# Altium schematic sheet Gate Drives.SchDoc
size D
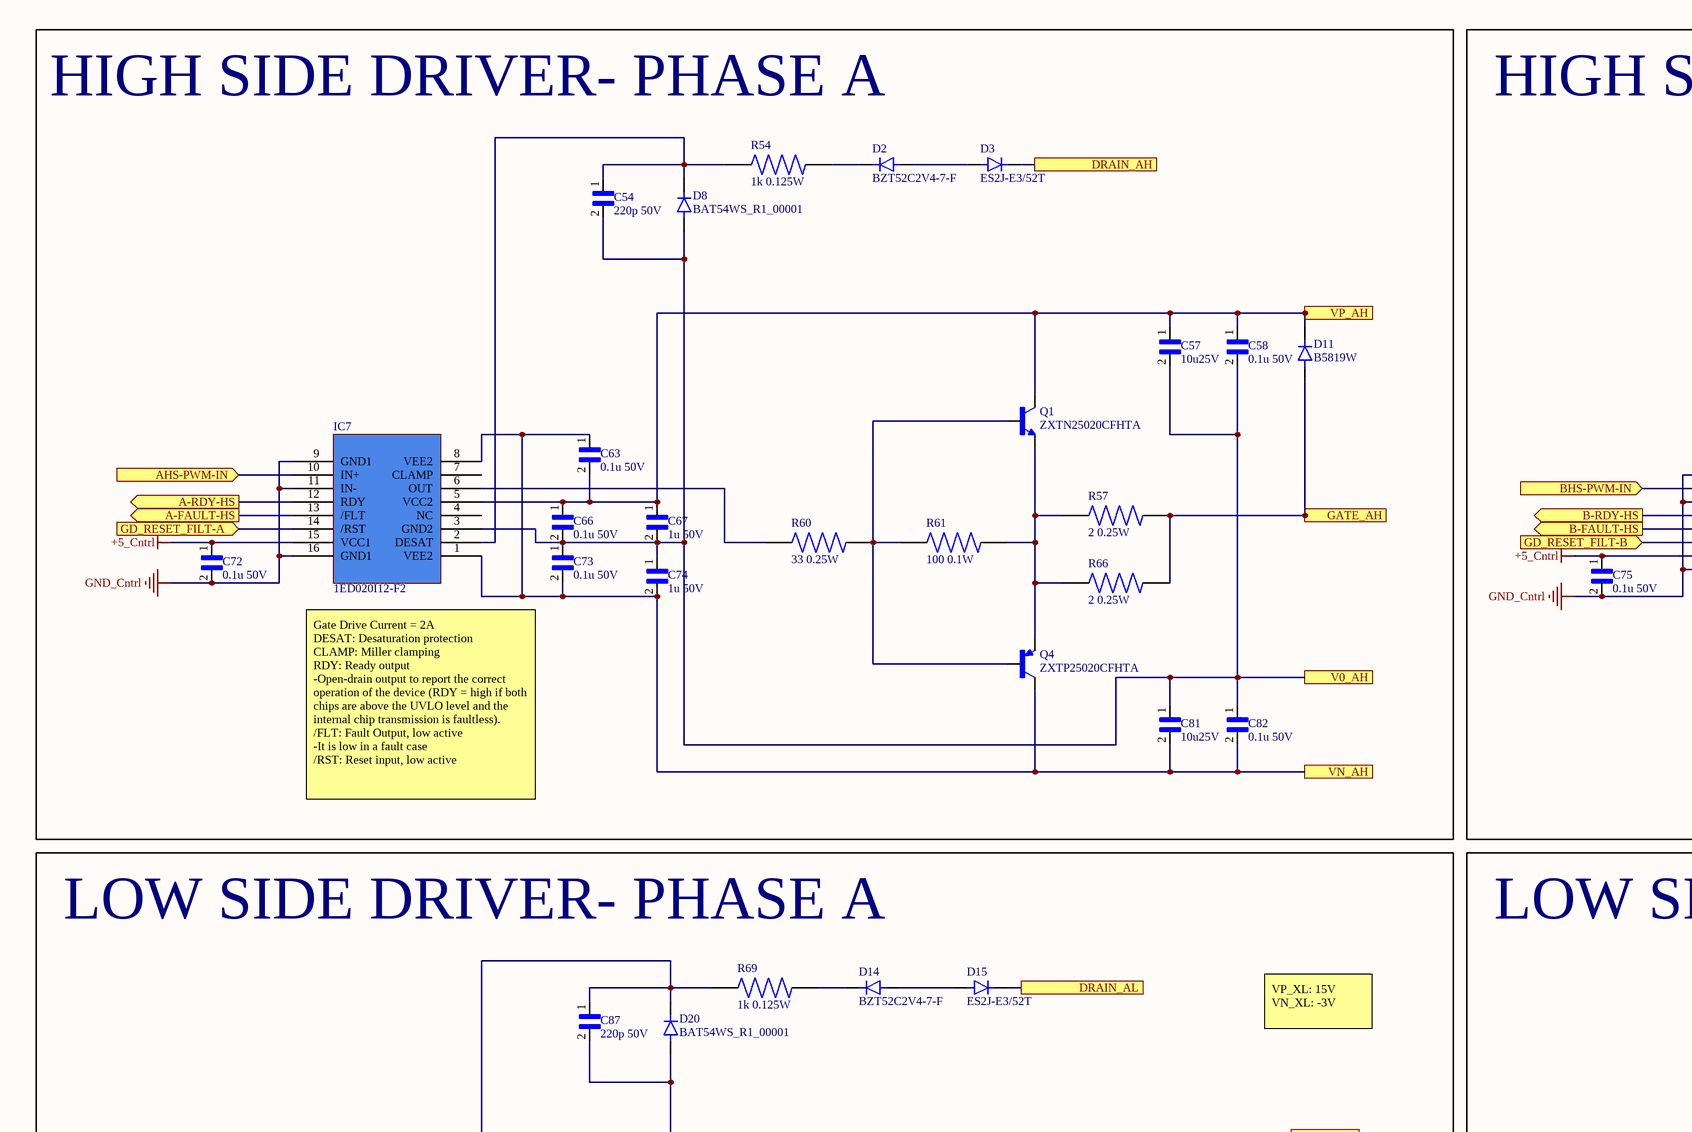
[diagram p0: Gate Drives.SchDoc, top left]
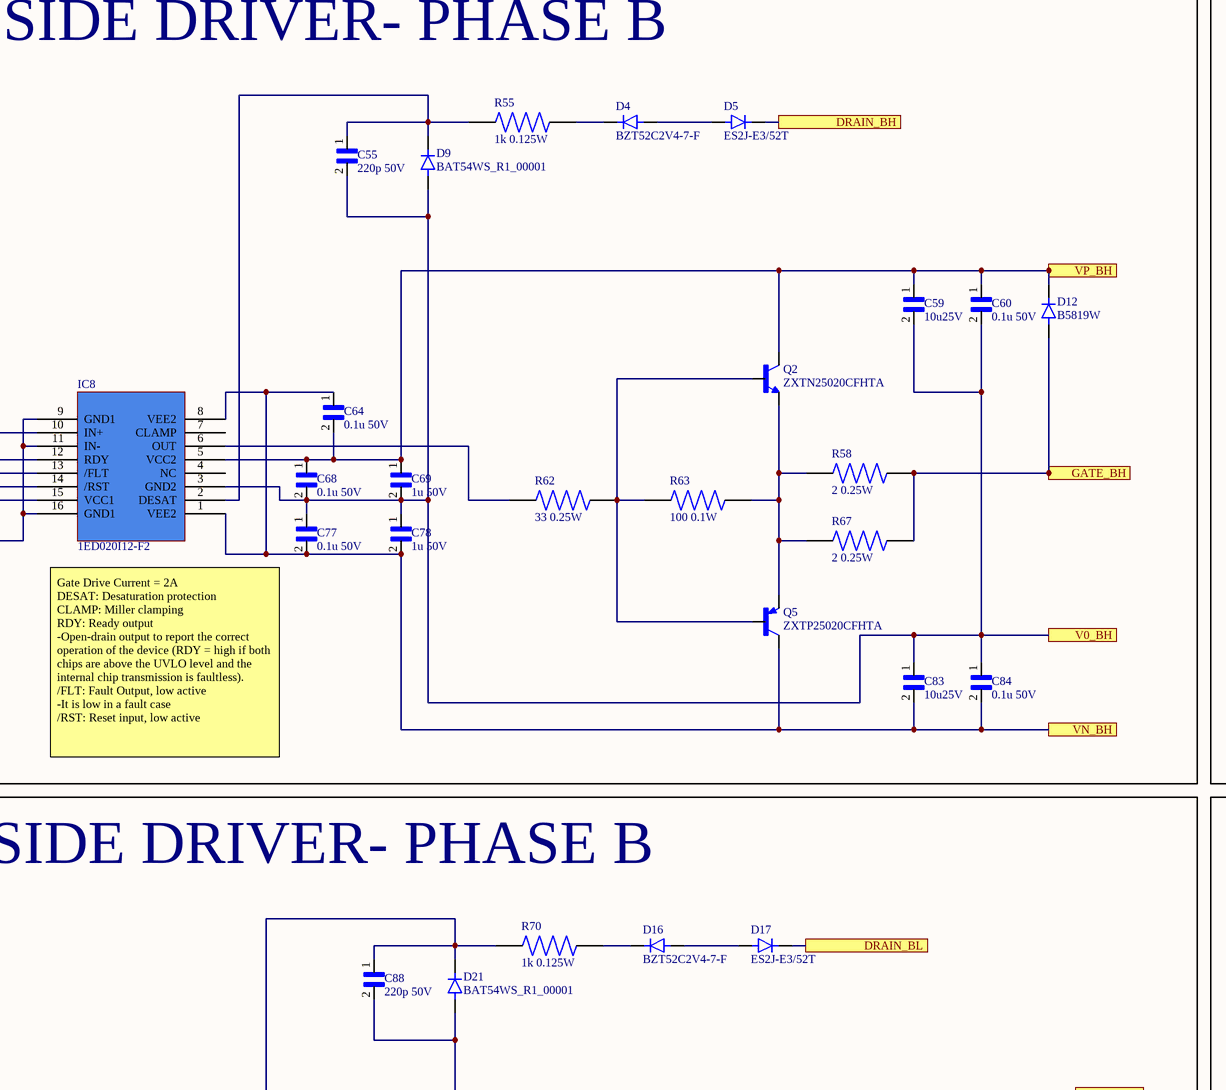
[diagram p1: Gate Drives.SchDoc, top middle]
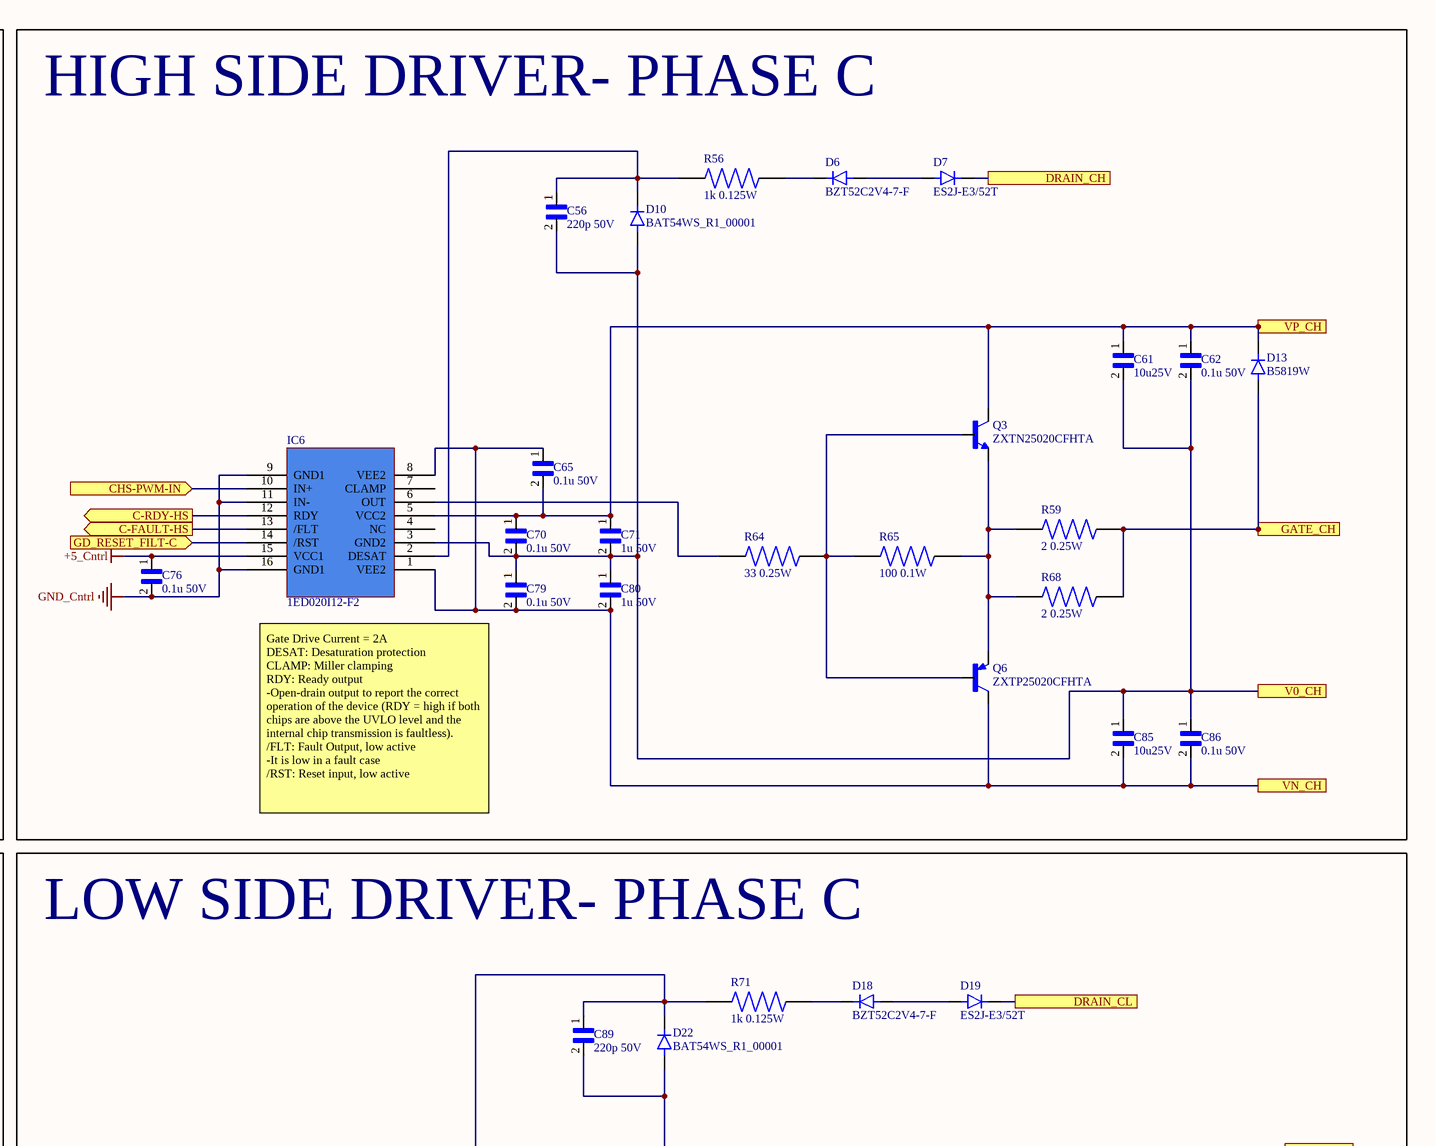
[diagram p2: Gate Drives.SchDoc, top right]
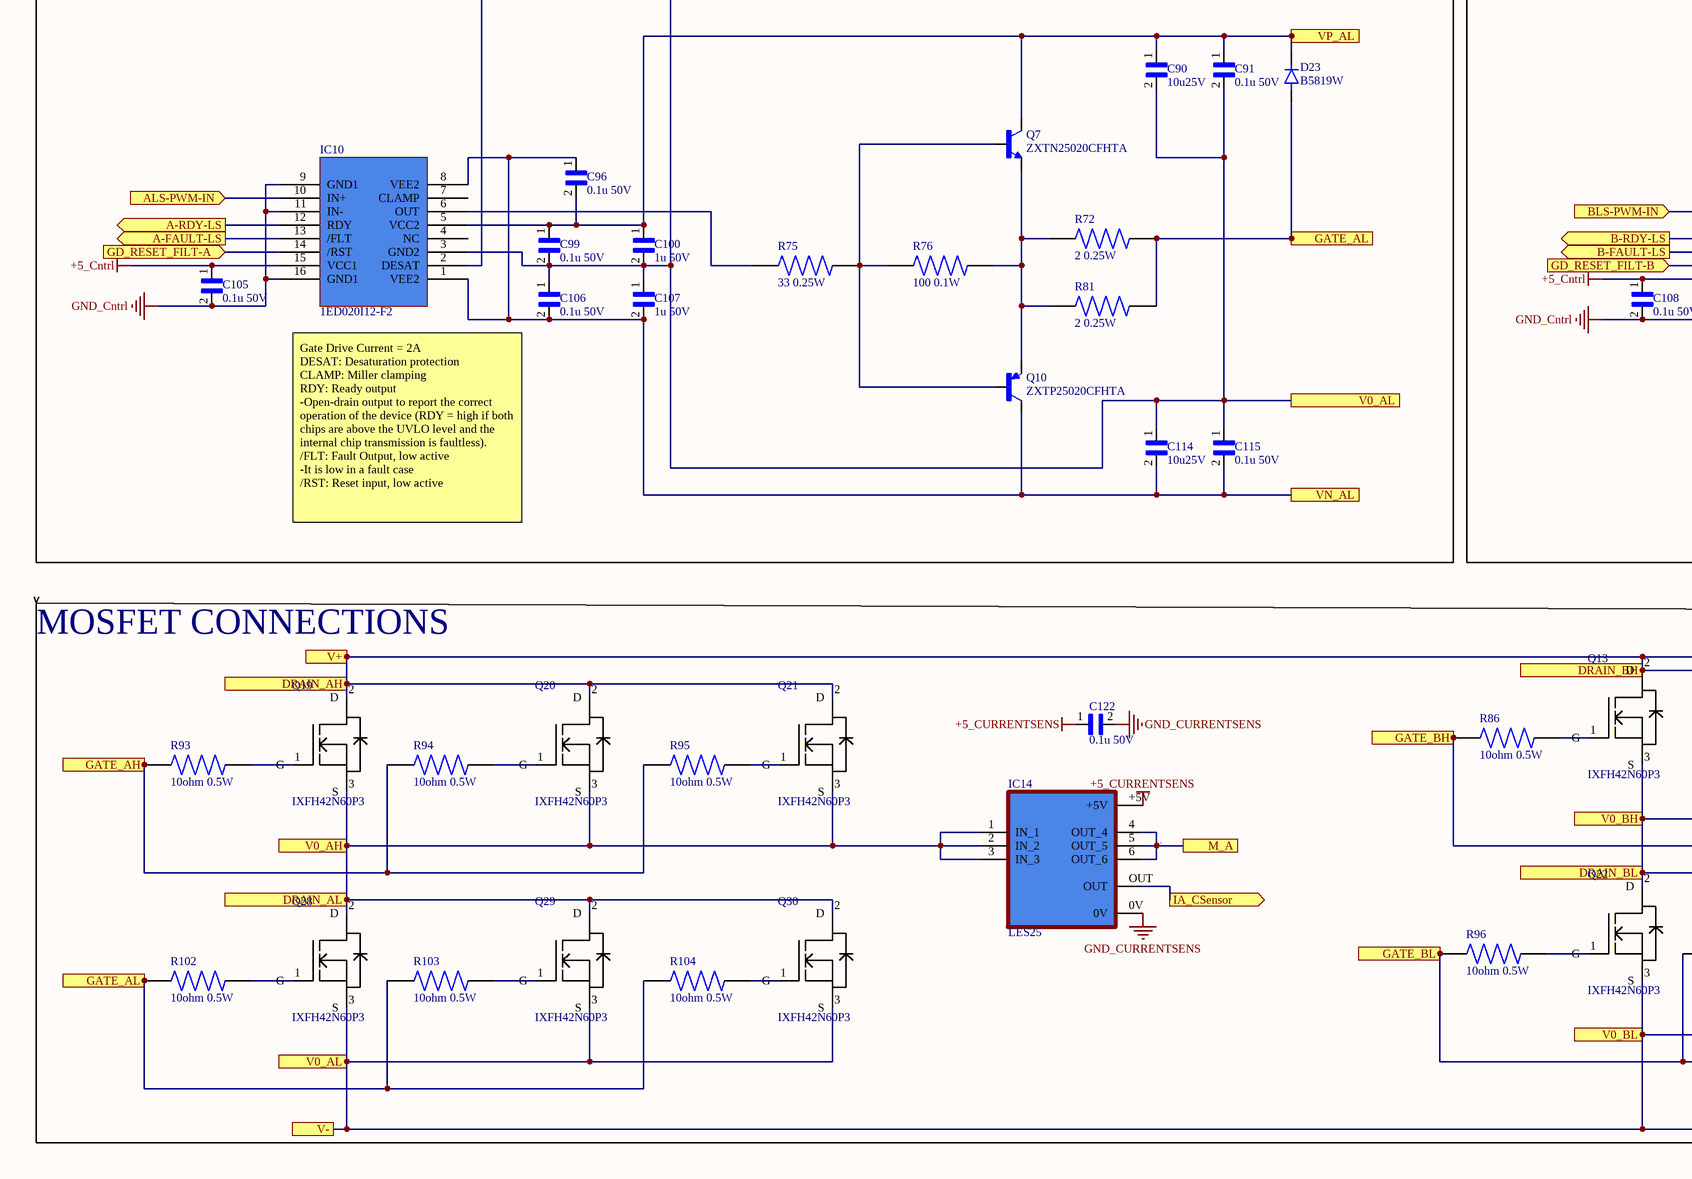
[diagram p3: Gate Drives.SchDoc, bottom left]
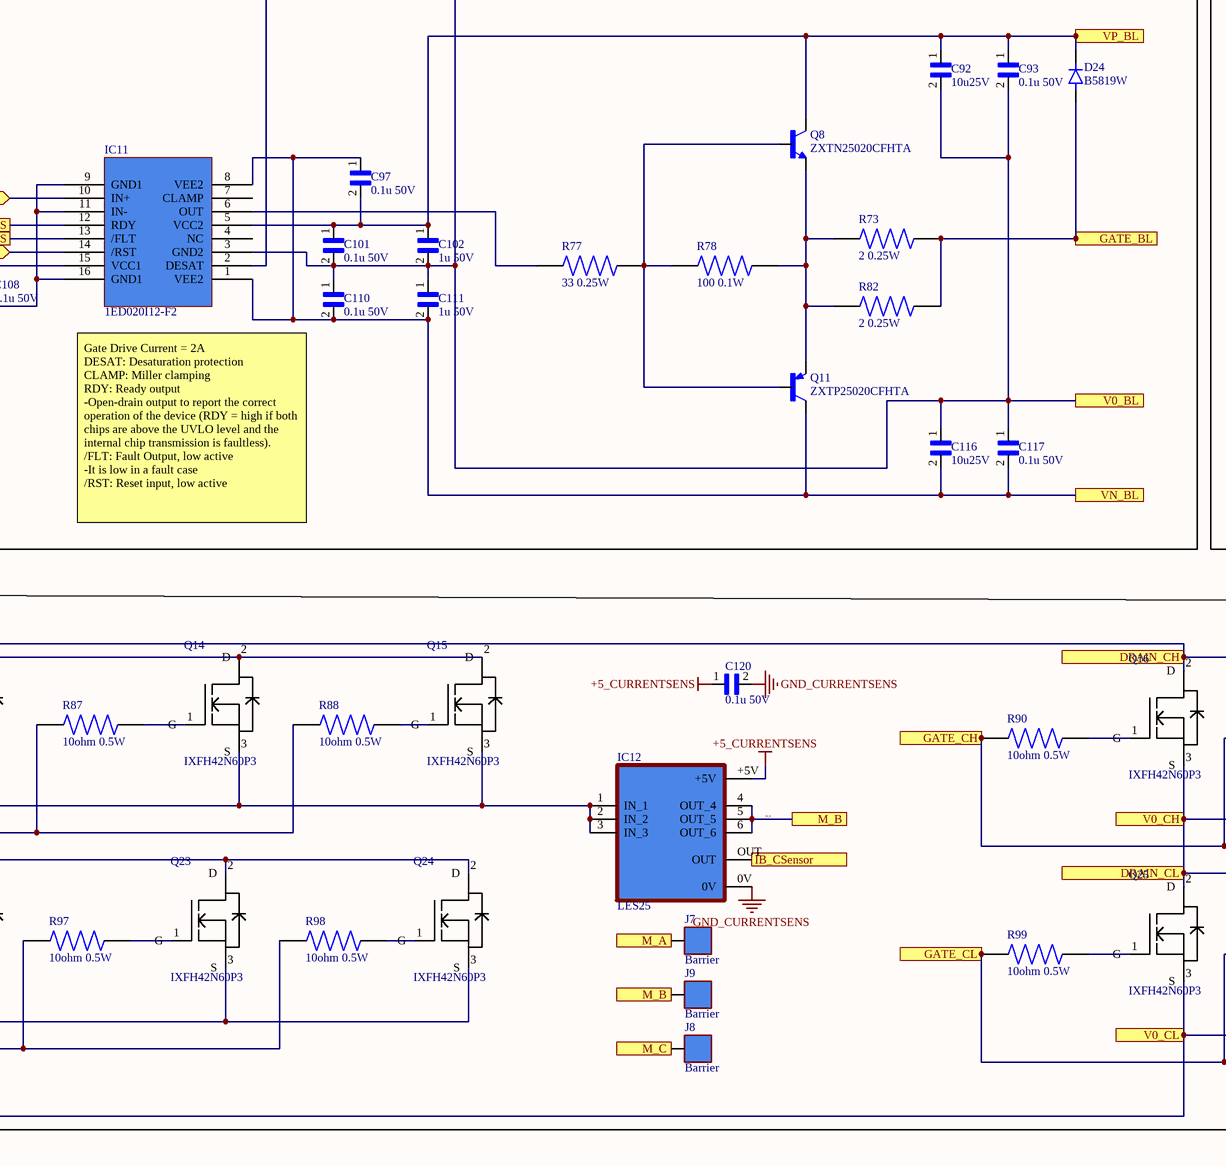
[diagram p4: Gate Drives.SchDoc, bottom middle]
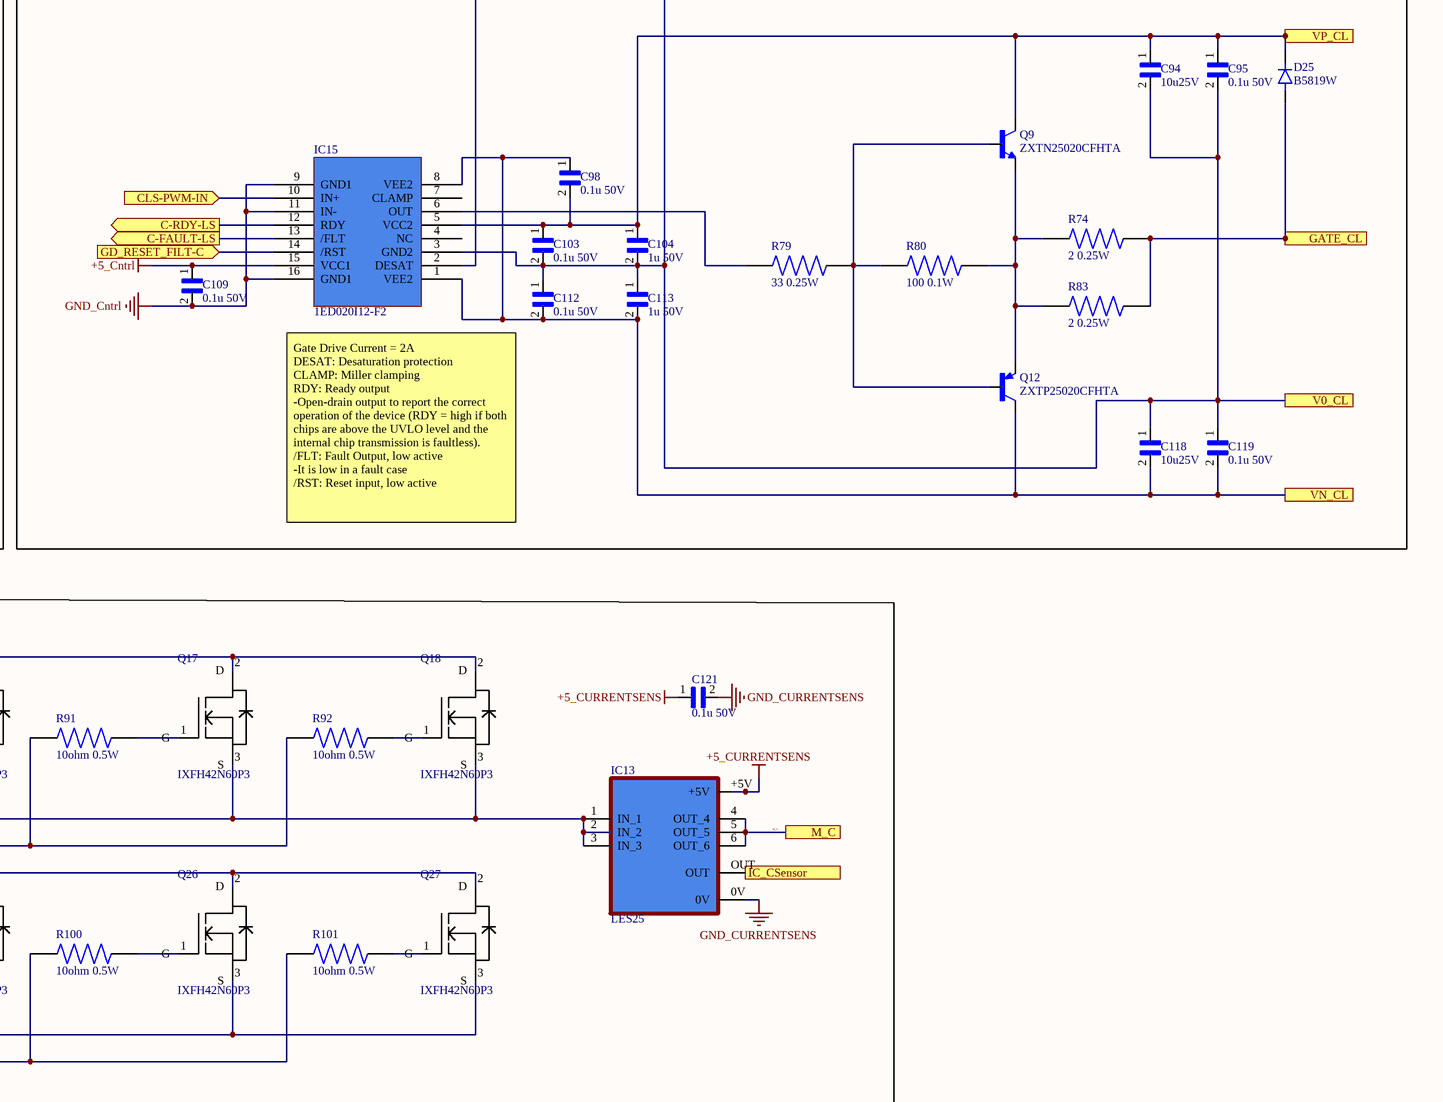
[diagram p5: Gate Drives.SchDoc, bottom right]

## Parts
C54  220p 50V  [CAP0805]
C55  220p 50V  [CAP0805]
C56  220p 50V  [CAP0805]
C57  10u25V  [CAP0805]
C58  0.1u 50V  [CAP0805]
C59  10u25V  [CAP0805]
C60  0.1u 50V  [CAP0805]
C61  10u25V  [CAP0805]
C62  0.1u 50V  [CAP0805]
C63  0.1u 50V  [CAP0805]
C64  0.1u 50V  [CAP0805]
C65  0.1u 50V  [CAP0805]
C66  0.1u 50V  [CAP0805]
C67  1u 50V  [CAP0805]
C68  0.1u 50V  [CAP0805]
C69  1u 50V  [CAP0805]
C70  0.1u 50V  [CAP0805]
C71  1u 50V  [CAP0805]
C72  0.1u 50V  [CAP0805]
C73  0.1u 50V  [CAP0805]
C74  1u 50V  [CAP0805]
C75  0.1u 50V  [CAP0805]
C76  0.1u 50V  [CAP0805]
C77  0.1u 50V  [CAP0805]
C78  1u 50V  [CAP0805]
C79  0.1u 50V  [CAP0805]
C80  1u 50V  [CAP0805]
C81  10u25V  [CAP0805]
C82  0.1u 50V  [CAP0805]
C83  10u25V  [CAP0805]
C84  0.1u 50V  [CAP0805]
C85  10u25V  [CAP0805]
C86  0.1u 50V  [CAP0805]
C87  220p 50V  [CAP0805]
C88  220p 50V  [CAP0805]
C89  220p 50V  [CAP0805]
C90  10u25V  [CAP0805]
C91  0.1u 50V  [CAP0805]
C92  10u25V  [CAP0805]
C93  0.1u 50V  [CAP0805]
C94  10u25V  [CAP0805]
C95  0.1u 50V  [CAP0805]
C96  0.1u 50V  [CAP0805]
C97  0.1u 50V  [CAP0805]
C98  0.1u 50V  [CAP0805]
C99  0.1u 50V  [CAP0805]
C100  1u 50V  [CAP0805]
C101  0.1u 50V  [CAP0805]
C102  1u 50V  [CAP0805]
C103  0.1u 50V  [CAP0805]
C104  1u 50V  [CAP0805]
C105  0.1u 50V  [CAP0805]
C106  0.1u 50V  [CAP0805]
C107  1u 50V  [CAP0805]
C108  0.1u 50V  [CAP0805]
C109  0.1u 50V  [CAP0805]
C110  0.1u 50V  [CAP0805]
C111  1u 50V  [CAP0805]
C112  0.1u 50V  [CAP0805]
C113  1u 50V  [CAP0805]
C114  10u25V  [CAP0805]
C115  0.1u 50V  [CAP0805]
C116  10u25V  [CAP0805]
C117  0.1u 50V  [CAP0805]
C118  10u25V  [CAP0805]
C119  0.1u 50V  [CAP0805]
C120  0.1u 50V  [CAP0805]
C121  0.1u 50V  [CAP0805]
C122  0.1u 50V  [CAP0805]
D2  BZT52C2V4-7-F  [BZT52C2V4-7-F]
D3  ES2J-E3/52T  [ES2J-E3/52T]
D4  BZT52C2V4-7-F  [BZT52C2V4-7-F]
D5  ES2J-E3/52T  [ES2J-E3/52T]
D6  BZT52C2V4-7-F  [BZT52C2V4-7-F]
D7  ES2J-E3/52T  [ES2J-E3/52T]
D8  BAT54WS_R1_00001  [BAT54WS_R1_00001]
D9  BAT54WS_R1_00001  [BAT54WS_R1_00001]
D10  BAT54WS_R1_00001  [BAT54WS_R1_00001]
D11  B5819W  [BZT52C2V4-7-F]
D12  B5819W  [BZT52C2V4-7-F]
D13  B5819W  [BZT52C2V4-7-F]
D14  BZT52C2V4-7-F  [BZT52C2V4-7-F]
D15  ES2J-E3/52T  [ES2J-E3/52T]
D16  BZT52C2V4-7-F  [BZT52C2V4-7-F]
D17  ES2J-E3/52T  [ES2J-E3/52T]
D18  BZT52C2V4-7-F  [BZT52C2V4-7-F]
D19  ES2J-E3/52T  [ES2J-E3/52T]
D20  BAT54WS_R1_00001  [BAT54WS_R1_00001]
D21  BAT54WS_R1_00001  [BAT54WS_R1_00001]
D22  BAT54WS_R1_00001  [BAT54WS_R1_00001]
D23  B5819W  [BZT52C2V4-7-F]
D24  B5819W  [BZT52C2V4-7-F]
D25  B5819W  [BZT52C2V4-7-F]
IC6  1ED020I12-F2  [SOIC127P1028X264-16N]
IC7  1ED020I12-F2  [SOIC127P1028X264-16N]
IC8  1ED020I12-F2  [SOIC127P1028X264-16N]
IC10  1ED020I12-F2  [SOIC127P1028X264-16N]
IC11  1ED020I12-F2  [SOIC127P1028X264-16N]
IC12  LES25  [LTS25]
IC13  LES25  [LTS25]
IC14  LES25  [LTS25]
IC15  1ED020I12-F2  [SOIC127P1028X264-16N]
J7  Barrier  [Barrier]
J8  Barrier  [Barrier]
J9  Barrier  [Barrier]
Q1  ZXTN25020CFHTA  [SOT23]
Q2  ZXTN25020CFHTA  [SOT23]
Q3  ZXTN25020CFHTA  [SOT23]
Q4  ZXTP25020CFHTA  [SOT23]
Q5  ZXTP25020CFHTA  [SOT23]
Q6  ZXTP25020CFHTA  [SOT23]
Q7  ZXTN25020CFHTA  [SOT23]
Q8  ZXTN25020CFHTA  [SOT23]
Q9  ZXTN25020CFHTA  [SOT23]
Q10  ZXTP25020CFHTA  [SOT23]
Q11  ZXTP25020CFHTA  [SOT23]
Q12  ZXTP25020CFHTA  [SOT23]
Q13  IXFH42N60P3  [IXFH42N60P3_v4]
Q14  IXFH42N60P3  [IXFH42N60P3_v4]
Q15  IXFH42N60P3  [IXFH42N60P3_v4]
Q16  IXFH42N60P3  [IXFH42N60P3_v4]
Q17  IXFH42N60P3  [IXFH42N60P3_v4]
Q18  IXFH42N60P3  [IXFH42N60P3_v4]
Q19  IXFH42N60P3  [IXFH42N60P3_v4]
Q20  IXFH42N60P3  [IXFH42N60P3_v4]
Q21  IXFH42N60P3  [IXFH42N60P3_v4]
Q22  IXFH42N60P3  [IXFH42N60P3_v4]
Q23  IXFH42N60P3  [IXFH42N60P3_v4]
Q24  IXFH42N60P3  [IXFH42N60P3_v4]
Q25  IXFH42N60P3  [IXFH42N60P3_v4]
Q26  IXFH42N60P3  [IXFH42N60P3_v4]
Q27  IXFH42N60P3  [IXFH42N60P3_v4]
Q28  IXFH42N60P3  [IXFH42N60P3_v4]
Q29  IXFH42N60P3  [IXFH42N60P3_v4]
Q30  IXFH42N60P3  [IXFH42N60P3_v4]
R54  1k 0.125W  [RES0805]
R55  1k 0.125W  [RES0805]
R56  1k 0.125W  [RES0805]
R57  2 0.25W  [RES0805]
R58  2 0.25W  [RES0805]
R59  2 0.25W  [RES0805]
R60  33 0.25W  [RES0805]
R61  100 0.1W  [RES0805]
R62  33 0.25W  [RES0805]
R63  100 0.1W  [RES0805]
R64  33 0.25W  [RES0805]
R65  100 0.1W  [RES0805]
R66  2 0.25W  [RES0805]
R67  2 0.25W  [RES0805]
R68  2 0.25W  [RES0805]
R69  1k 0.125W  [RES0805]
R70  1k 0.125W  [RES0805]
R71  1k 0.125W  [RES0805]
R72  2 0.25W  [RES0805]
R73  2 0.25W  [RES0805]
R74  2 0.25W  [RES0805]
R75  33 0.25W  [RES0805]
R76  100 0.1W  [RES0805]
R77  33 0.25W  [RES0805]
R78  100 0.1W  [RES0805]
R79  33 0.25W  [RES0805]
R80  100 0.1W  [RES0805]
R81  2 0.25W  [RES0805]
R82  2 0.25W  [RES0805]
R83  2 0.25W  [RES0805]
R86  10ohm 0.5W  [1206RES]
R87  10ohm 0.5W  [1206RES]
R88  10ohm 0.5W  [1206RES]
R90  10ohm 0.5W  [1206RES]
R91  10ohm 0.5W  [1206RES]
R92  10ohm 0.5W  [1206RES]
R93  10ohm 0.5W  [1206RES]
R94  10ohm 0.5W  [1206RES]
R95  10ohm 0.5W  [1206RES]
R96  10ohm 0.5W  [1206RES]
R97  10ohm 0.5W  [1206RES]
R98  10ohm 0.5W  [1206RES]
R99  10ohm 0.5W  [1206RES]
R100  10ohm 0.5W  [1206RES]
R101  10ohm 0.5W  [1206RES]
R102  10ohm 0.5W  [1206RES]
R103  10ohm 0.5W  [1206RES]
R104  10ohm 0.5W  [1206RES]

## Blocks framed on the sheet
HIGH SIDE DRIVER- PHASE A: C54 C57 C58 C63 C66 C67 C72-C74 C81 C82 D2 D3 D8 D11 IC7 Q1 Q4 R54 R57 R60 R61 R66
HIGH SIDE DRIVER- PHASE B: C55 C59 C60 C64 C68 C69 C75 C77 C78 C83 C84 D4 D5 D9 D12 IC8 Q2 Q5 R55 R58 R62 R63 R67
HIGH SIDE DRIVER- PHASE C: C56 C61 C62 C65 C70 C71 C76 C79 C80 C85 C86 D6 D7 D10 D13 IC6 Q3 Q6 R56 R59 R64 R65 R68
LOW SIDE DRIVER- PHASE A: C87 C90 C91 C96 C99 C100 C105-C107 C114 C115 D14 D15 D20 D23 IC10 Q7 Q10 R69 R72 R75 R76 R81
LOW SIDE DRIVER- PHASE B: C88 C92 C93 C97 C101 C102 C108 C110 C111 C116 C117 D16 D17 D21 D24 IC11 Q8 Q11 R70 R73 R77 R78 R82
LOW SIDE DRIVER- PHASE C: C89 C94 C95 C98 C103 C104 C109 C112 C113 C118 C119 D18 D19 D22 D25 IC15 Q9 Q12 R71 R74 R79 R80 R83
MOSFET CONNECTIONS: C120-C122 IC12-IC14 J7-J9 Q13-Q30 R86-R88 R90-R104

## Ports
A-FAULT-HS (out), A-FAULT-LS (out), A-RDY-HS (out), A-RDY-LS (out), AHS-PWM-IN (in), ALS-PWM-IN (in), B-FAULT-HS (out), B-FAULT-LS (out), B-RDY-HS (out), B-RDY-LS (out), BHS-PWM-IN (in), BLS-PWM-IN (in), C-FAULT-HS (out), C-FAULT-LS (out), C-RDY-HS (out), C-RDY-LS (out), CHS-PWM-IN (in), CLS-PWM-IN (in), DRAIN_AH, DRAIN_AL, DRAIN_BH, DRAIN_BL, DRAIN_CH, DRAIN_CL, GATE_AH, GATE_AL, GATE_BH, GATE_BL, GATE_CH, GATE_CL, GD_RESET_FILT-A (in), GD_RESET_FILT-B (in), GD_RESET_FILT-C (in), IA_CSensor (out), IB_CSensor (out), IC_CSensor (out), M_A, M_B, M_C, V0_AH, V0_AL, V0_BH, V0_BL, V0_CH, V0_CL, V+, V-, VN_AH, VN_AL, VN_BH, VN_BL, VN_CH, VN_CL, VP_AH, VP_AL, VP_BH, VP_BL, VP_CH, VP_CL

## Nets
+5_Cntrl: C72.1 C75.1 C76.1 C105.1 C108.1 C109.1 IC6.15(VCC1) IC7.15(VCC1) IC8.15(VCC1) IC10.15(VCC1) IC11.15(VCC1) IC15.15(VCC1)
+5_CURRENTSENS: C120.1 C121.1 C122.1 IC12.+5V IC13.+5V IC14.+5V
GND_Cntrl: C72.2 C75.2 C76.2 C105.2 C108.2 C109.2 IC6.9(GND1) IC6.11(IN-) IC6.16(GND1) IC7.9(GND1) IC7.11(IN-) IC7.16(GND1) IC8.9(GND1) IC8.11(IN-) IC8.16(GND1) IC10.9(GND1) IC10.11(IN-) IC10.16(GND1) IC11.9(GND1) IC11.11(IN-) IC11.16(GND1) IC15.9(GND1) IC15.11(IN-) IC15.16(GND1)
GND_CURRENTSENS: C120.2 C121.2 C122.2 IC12.0V IC13.0V IC14.0V
A-FAULT-HS: IC7.13(/FLT) ; port A-FAULT-HS
A-FAULT-LS: IC10.13(/FLT) ; port A-FAULT-LS
A-RDY-HS: IC7.12(RDY) ; port A-RDY-HS
A-RDY-LS: IC10.12(RDY) ; port A-RDY-LS
AHS-PWM-IN: IC7.10(IN+) ; port AHS-PWM-IN
ALS-PWM-IN: IC10.10(IN+) ; port ALS-PWM-IN
B-FAULT-HS: IC8.13(/FLT) ; port B-FAULT-HS
B-FAULT-LS: IC11.13(/FLT) ; port B-FAULT-LS
B-RDY-HS: IC8.12(RDY) ; port B-RDY-HS
B-RDY-LS: IC11.12(RDY) ; port B-RDY-LS
BHS-PWM-IN: IC8.10(IN+) ; port BHS-PWM-IN
BLS-PWM-IN: IC11.10(IN+) ; port BLS-PWM-IN
C-FAULT-HS: IC6.13(/FLT) ; port C-FAULT-HS
C-FAULT-LS: IC15.13(/FLT) ; port C-FAULT-LS
C-RDY-HS: IC6.12(RDY) ; port C-RDY-HS
C-RDY-LS: IC15.12(RDY) ; port C-RDY-LS
CHS-PWM-IN: IC6.10(IN+) ; port CHS-PWM-IN
CLS-PWM-IN: IC15.10(IN+) ; port CLS-PWM-IN
DRAIN_AH: D3.1(Cathode) D5.1(Cathode) D7.1(Cathode) Q13.2(D) Q14.2(D) Q15.2(D) Q16.2(D) Q17.2(D) Q18.2(D) Q19.2(D) Q20.2(D) Q21.2(D) ; port DRAIN_AH, port DRAIN_BH, port DRAIN_CH, port V+
DRAIN_AL: C54.2 C57.2 C58.2 C66.2 C67.2 C73.1 C74.1 C81.1 C82.1 D8.2(Anode) D15.1(Cathode) IC7.3(GND2) IC14.1(IN_1) IC14.2(IN_2) IC14.3(IN_3) Q19.3(S) Q20.3(S) Q21.3(S) Q28.2(D) Q29.2(D) Q30.2(D) ; port V0_AH, port DRAIN_AL
DRAIN_BL: C55.2 C59.2 C60.2 C68.2 C69.2 C77.1 C78.1 C83.1 C84.1 D9.2(Anode) D17.1(Cathode) IC8.3(GND2) IC12.1(IN_1) IC12.2(IN_2) IC12.3(IN_3) Q13.3(S) Q14.3(S) Q15.3(S) Q22.2(D) Q23.2(D) Q24.2(D) ; port V0_BH, port DRAIN_BL
DRAIN_CL: C56.2 C61.2 C62.2 C70.2 C71.2 C79.1 C80.1 C85.1 C86.1 D10.2(Anode) D19.1(Cathode) IC6.3(GND2) IC13.1(IN_1) IC13.2(IN_2) IC13.3(IN_3) Q16.3(S) Q17.3(S) Q18.3(S) Q25.2(D) Q26.2(D) Q27.2(D) ; port V0_CH, port DRAIN_CL
GATE_AH: D11.2(Anode) R57.2 R66.2 R93.1 R94.1 R95.1 ; port GATE_AH
GATE_AL: D23.2(Anode) R72.2 R81.2 R102.1 R103.1 R104.1 ; port GATE_AL
GATE_BH: D12.2(Anode) R58.2 R67.2 R86.1 R87.1 R88.1 ; port GATE_BH
GATE_BL: D24.2(Anode) R73.2 R82.2 R96.1 R97.1 R98.1 ; port GATE_BL
GATE_CH: D13.2(Anode) R59.2 R68.2 R90.1 R91.1 R92.1 ; port GATE_CH
GATE_CL: D25.2(Anode) R74.2 R83.2 R99.1 R100.1 R101.1 ; port GATE_CL
GD_RESET_FILT-A: IC7.14(/RST) IC10.14(/RST) ; port GD_RESET_FILT-A
GD_RESET_FILT-B: IC8.14(/RST) IC11.14(/RST) ; port GD_RESET_FILT-B
GD_RESET_FILT-C: IC6.14(/RST) IC15.14(/RST) ; port GD_RESET_FILT-C
IA_CSensor: IC14.OUT ; port IA_CSensor
IB_CSensor: IC12.OUT ; port IB_CSensor
IC_CSensor: IC13.OUT ; port IC_CSensor
M_A: IC14.4(OUT_4) IC14.5(OUT_5) IC14.6(OUT_6) J7.1 ; port M_A
M_B: IC12.4(OUT_4) IC12.5(OUT_5) IC12.6(OUT_6) J9.1 ; port M_B
M_C: IC13.4(OUT_4) IC13.5(OUT_5) IC13.6(OUT_6) J8.1 ; port M_C
V-: C87.2 C88.2 C89.2 C90.2 C91.2 C92.2 C93.2 C94.2 C95.2 C99.2 C100.2 C101.2 C102.2 C103.2 C104.2 C106.1 C107.1 C110.1 C111.1 C112.1 C113.1 C114.1 C115.1 C116.1 C117.1 C118.1 C119.1 D20.2(Anode) D21.2(Anode) D22.2(Anode) IC10.3(GND2) IC11.3(GND2) IC15.3(GND2) Q22.3(S) Q23.3(S) Q24.3(S) Q25.3(S) Q26.3(S) Q27.3(S) Q28.3(S) Q29.3(S) Q30.3(S) ; port V0_AL, port V0_BL, port V0_CL, port V-
VN_AH: C63.1 C73.2 C74.2 C81.2 C82.2 IC7.1(VEE2) IC7.8(VEE2) Q4.3(C) ; port VN_AH
VN_AL: C96.1 C106.2 C107.2 C114.2 C115.2 IC10.1(VEE2) IC10.8(VEE2) Q10.3(C) ; port VN_AL
VN_BH: C64.1 C77.2 C78.2 C83.2 C84.2 IC8.1(VEE2) IC8.8(VEE2) Q5.3(C) ; port VN_BH
VN_BL: C97.1 C110.2 C111.2 C116.2 C117.2 IC11.1(VEE2) IC11.8(VEE2) Q11.3(C) ; port VN_BL
VN_CH: C65.1 C79.2 C80.2 C85.2 C86.2 IC6.1(VEE2) IC6.8(VEE2) Q6.3(C) ; port VN_CH
VN_CL: C98.1 C112.2 C113.2 C118.2 C119.2 IC15.1(VEE2) IC15.8(VEE2) Q12.3(C) ; port VN_CL
VP_AH: C57.1 C58.1 C63.2 C66.1 C67.1 D11.1(Cathode) IC7.5(VCC2) Q1.3(C) ; port VP_AH
VP_AL: C90.1 C91.1 C96.2 C99.1 C100.1 D23.1(Cathode) IC10.5(VCC2) Q7.3(C) ; port VP_AL
VP_BH: C59.1 C60.1 C64.2 C68.1 C69.1 D12.1(Cathode) IC8.5(VCC2) Q2.3(C) ; port VP_BH
VP_BL: C92.1 C93.1 C97.2 C101.1 C102.1 D24.1(Cathode) IC11.5(VCC2) Q8.3(C) ; port VP_BL
VP_CH: C61.1 C62.1 C65.2 C70.1 C71.1 D13.1(Cathode) IC6.5(VCC2) Q3.3(C) ; port VP_CH
VP_CL: C94.1 C95.1 C98.2 C103.1 C104.1 D25.1(Cathode) IC15.5(VCC2) Q9.3(C) ; port VP_CL
NetC54_1: C54.1 D8.1(Cathode) IC7.2(DESAT) R54.1
NetC55_1: C55.1 D9.1(Cathode) IC8.2(DESAT) R55.1
NetC56_1: C56.1 D10.1(Cathode) IC6.2(DESAT) R56.1
NetC87_1: C87.1 D20.1(Cathode) IC10.2(DESAT) R69.1
NetC88_1: C88.1 D21.1(Cathode) IC11.2(DESAT) R70.1
NetC89_1: C89.1 D22.1(Cathode) IC15.2(DESAT) R71.1
NetD2_1: D2.1(Cathode) R54.2
NetD2_2: D2.2(Anode) D3.2(Anode)
NetD4_1: D4.1(Cathode) R55.2
NetD4_2: D4.2(Anode) D5.2(Anode)
NetD6_1: D6.1(Cathode) R56.2
NetD6_2: D6.2(Anode) D7.2(Anode)
NetD14_1: D14.1(Cathode) R69.2
NetD14_2: D14.2(Anode) D15.2(Anode)
NetD16_1: D16.1(Cathode) R70.2
NetD16_2: D16.2(Anode) D17.2(Anode)
NetD18_1: D18.1(Cathode) R71.2
NetD18_2: D18.2(Anode) D19.2(Anode)
NetIC6_6: IC6.6(OUT) R64.1
NetIC7_6: IC7.6(OUT) R60.1
NetIC8_6: IC8.6(OUT) R62.1
NetIC10_6: IC10.6(OUT) R75.1
NetIC11_6: IC11.6(OUT) R77.1
NetIC15_6: IC15.6(OUT) R79.1
NetQ1_1: Q1.1(B) Q4.1(B) R60.2 R61.1
NetQ1_2: Q1.2(E) Q4.2(E) R57.1 R61.2 R66.1
NetQ2_1: Q2.1(B) Q5.1(B) R62.2 R63.1
NetQ2_2: Q2.2(E) Q5.2(E) R58.1 R63.2 R67.1
NetQ3_1: Q3.1(B) Q6.1(B) R64.2 R65.1
NetQ3_2: Q3.2(E) Q6.2(E) R59.1 R65.2 R68.1
NetQ7_1: Q7.1(B) Q10.1(B) R75.2 R76.1
NetQ7_2: Q7.2(E) Q10.2(E) R72.1 R76.2 R81.1
NetQ8_1: Q8.1(B) Q11.1(B) R77.2 R78.1
NetQ8_2: Q8.2(E) Q11.2(E) R73.1 R78.2 R82.1
NetQ9_1: Q9.1(B) Q12.1(B) R79.2 R80.1
NetQ9_2: Q9.2(E) Q12.2(E) R74.1 R80.2 R83.1
NetQ13_1: Q13.1(G) R86.2
NetQ14_1: Q14.1(G) R87.2
NetQ15_1: Q15.1(G) R88.2
NetQ16_1: Q16.1(G) R90.2
NetQ17_1: Q17.1(G) R91.2
NetQ18_1: Q18.1(G) R92.2
NetQ19_1: Q19.1(G) R93.2
NetQ20_1: Q20.1(G) R94.2
NetQ21_1: Q21.1(G) R95.2
NetQ22_1: Q22.1(G) R96.2
NetQ23_1: Q23.1(G) R97.2
NetQ24_1: Q24.1(G) R98.2
NetQ25_1: Q25.1(G) R99.2
NetQ26_1: Q26.1(G) R100.2
NetQ27_1: Q27.1(G) R101.2
NetQ28_1: Q28.1(G) R102.2
NetQ29_1: Q29.1(G) R103.2
NetQ30_1: Q30.1(G) R104.2

Not connected (* = marked no-connect by the designer): IC6 4(NC) 7(CLAMP); IC7 4(NC) 7(CLAMP); IC8 4(NC) 7(CLAMP); IC10 4(NC) 7(CLAMP); IC11 4(NC) 7(CLAMP); IC15 4(NC) 7(CLAMP)

## Notes on the sheet
- Gate Drive Current = 2A
  DESAT: Desaturation protection
  CLAMP: Miller clamping
  RDY: Ready output
  -Open-drain output to report the correct operation of the device (RDY = high if both chips are above the UVLO level and the internal chip transmission is faultless).
  /FLT: Fault Output, low active
  -It is low in a fault case
  /RST: Reset input, low active
- VP_XL: 15V
  VN_XL: -3V

## Library data of the parts
C54-C122 = CAP0805
D11-D13 D23-D25 = B5819W: DIODE SCHOTTKY 1A 40V SOD123
Q1-Q3 Q7-Q9 = ZXTN25020CFHTA: NPN 4.5A SOT23
Q4-Q6 Q10-Q12 = ZXTP25020CFHTA: PNP 4A SOT23
R54-R83 = RES0805
R86-R88 R90-R104 = 249k 1206: 1206 RES